# EAGLE design ir_ring_2022_04 (EAGLE 9.6.2)
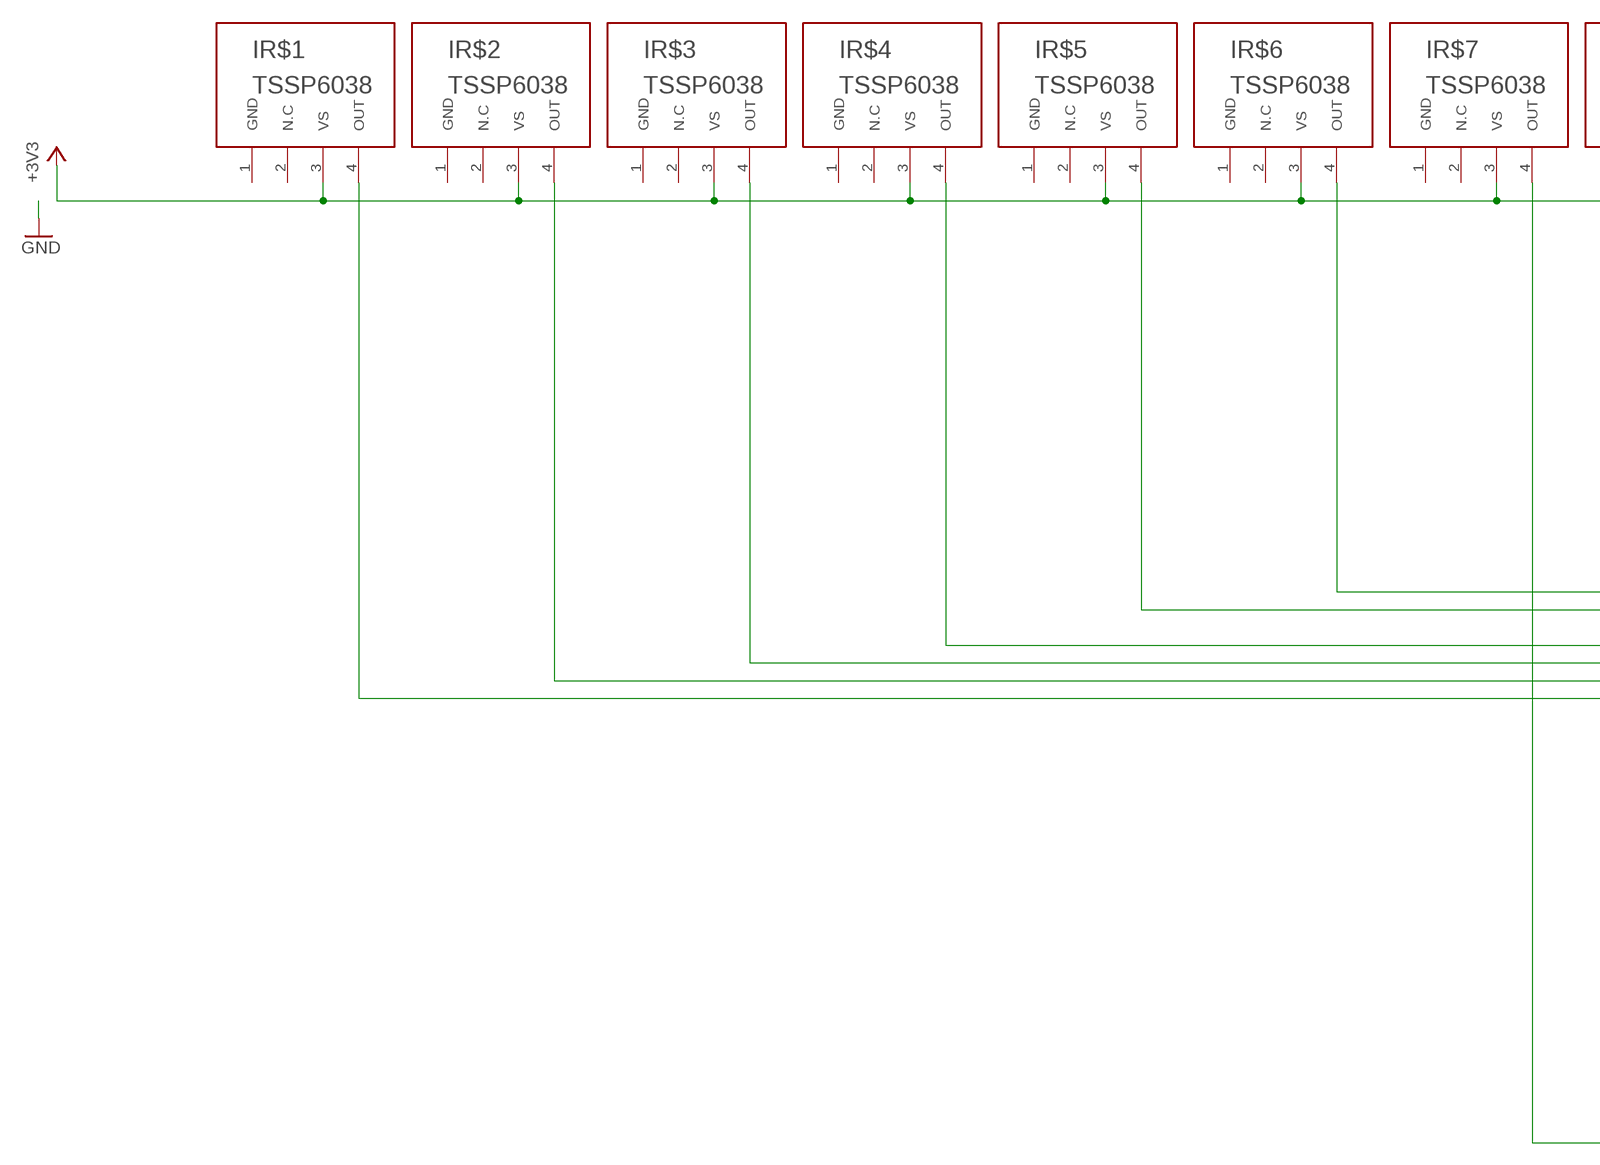
[diagram p0: schematic, sheet 1, part 1 of 2]
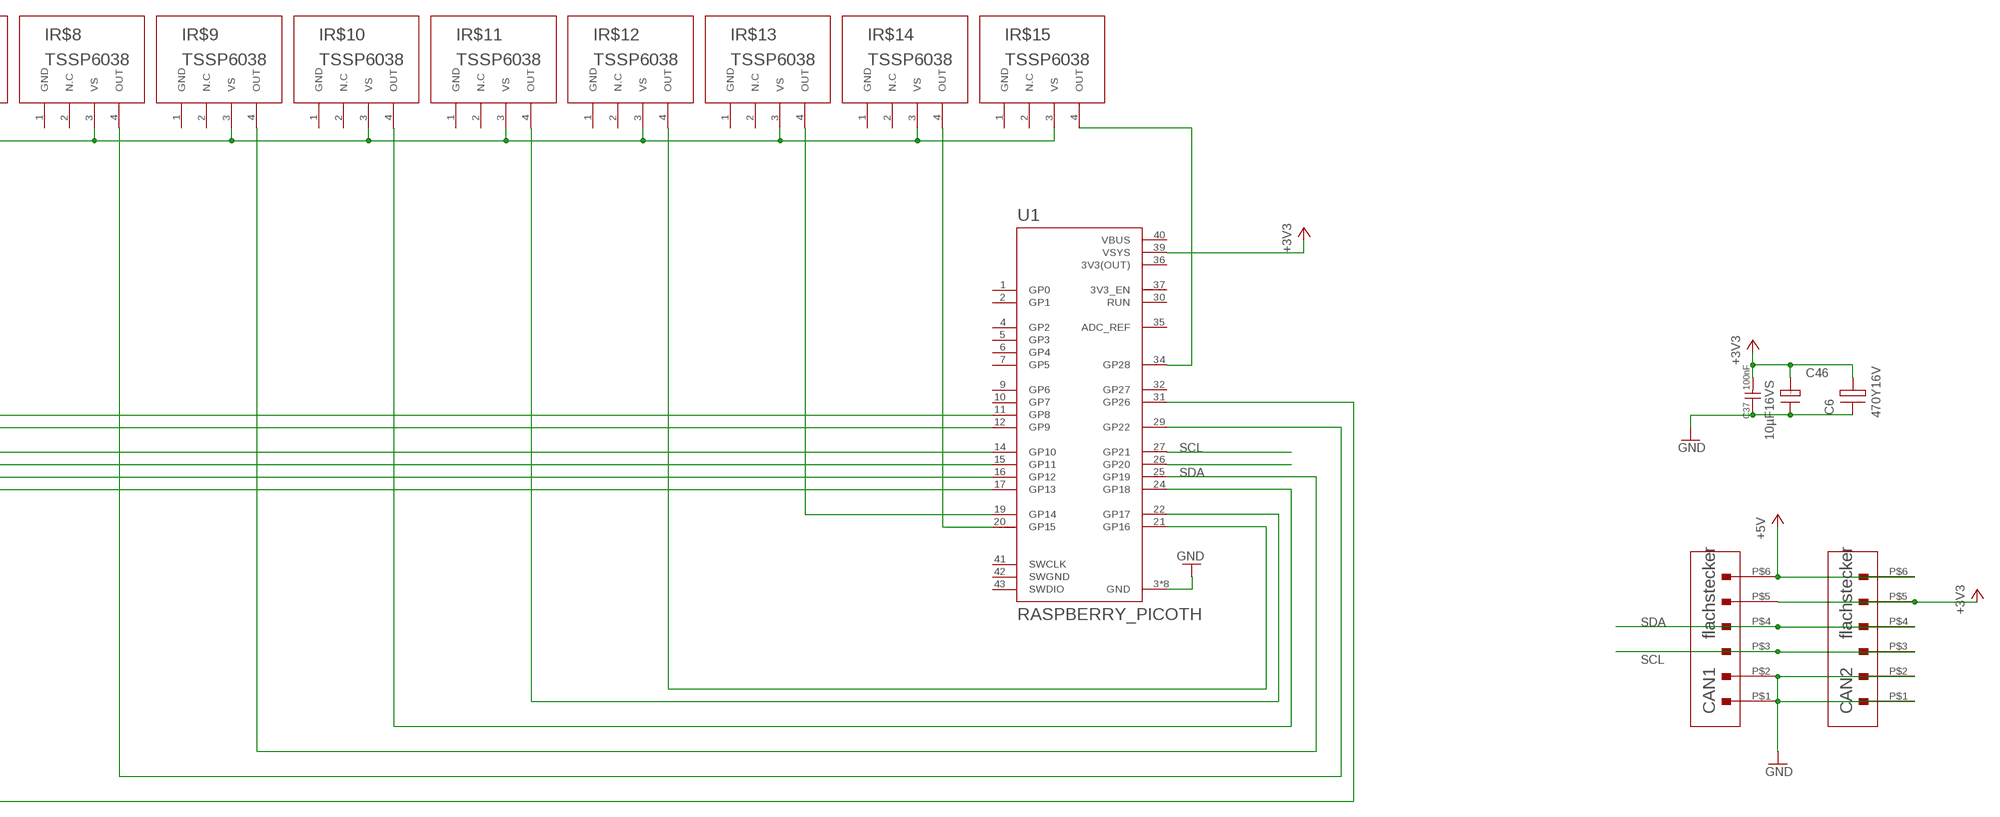
[diagram p1: schematic, sheet 1, part 2 of 2]

## Parts
C6  470Y16V  [150CLZ-1010]
C37  100nF  C0805  [0805]
C46  10µF16VS  [TANTALC]
CAN1  flachstecker  MOLEX104078-0610  [MOLEX104078-0610]
CAN2  flachstecker  MOLEX104078-0610  [MOLEX104078-0610]
IR$1  TSSP6038  [TSSP6038]
IR$2  TSSP6038  [TSSP6038]
IR$3  TSSP6038  [TSSP6038]
IR$4  TSSP6038  [TSSP6038]
IR$5  TSSP6038  [TSSP6038]
IR$6  TSSP6038  [TSSP6038]
IR$7  TSSP6038  [TSSP6038]
IR$8  TSSP6038  [TSSP6038]
IR$9  TSSP6038  [TSSP6038]
IR$10  TSSP6038  [TSSP6038]
IR$11  TSSP6038  [TSSP6038]
IR$12  TSSP6038  [TSSP6038]
IR$13  TSSP6038  [TSSP6038]
IR$14  TSSP6038  [TSSP6038]
IR$15  TSSP6038  [TSSP6038]
U1  RASPBERRY_PICOTH  [PICO-PKG-TH]

## Nets
+3V3: C6.+ C37.1 C46.+ CAN1.P$5 CAN2.P$5 IR$1.3(VS) IR$2.3(VS) IR$3.3(VS) IR$4.3(VS) IR$5.3(VS) IR$6.3(VS) IR$7.3(VS) IR$8.3(VS) IR$9.3(VS) IR$10.3(VS) IR$11.3(VS) IR$12.3(VS) IR$13.3(VS) IR$14.3(VS) IR$15.3(VS) U1.39(VSYS)
+5V: CAN1.P$6 CAN2.P$6
GND: C6.- C37.2 C46.- CAN1.P$1 CAN1.P$2 CAN2.P$1 CAN2.P$2 U1.3(GND) U1.8(GND) U1.13(GND) U1.18(GND) U1.23(GND) U1.28(GND) U1.33(GND) U1.38(GND)
N$1: IR$1.4(OUT) U1.17(GP13)
N$2: IR$2.4(OUT) U1.16(GP12)
N$3: IR$3.4(OUT) U1.15(GP11)
N$4: IR$4.4(OUT) U1.14(GP10)
N$5: IR$5.4(OUT) U1.12(GP9)
N$6: IR$6.4(OUT) U1.11(GP8)
N$7: IR$7.4(OUT) U1.31(GP26)
N$8: IR$8.4(OUT) U1.29(GP22)
N$9: IR$9.4(OUT) U1.25(GP19)
N$10: IR$10.4(OUT) U1.24(GP18)
N$11: IR$11.4(OUT) U1.22(GP17)
N$12: IR$12.4(OUT) U1.21(GP16)
N$13: IR$14.4(OUT) U1.20(GP15)
N$14: IR$13.4(OUT) U1.19(GP14)
N$15: IR$15.4(OUT) U1.34(GP28)
SCL: CAN1.P$3 CAN2.P$3 U1.27(GP21)
SDA: CAN1.P$4 CAN2.P$4 U1.26(GP20)
Unconnected: IR$1.2(N.C) IR$2.2(N.C) IR$3.2(N.C) IR$4.2(N.C) IR$5.2(N.C) IR$6.2(N.C) IR$7.2(N.C) IR$8.2(N.C) IR$9.2(N.C) IR$10.2(N.C) IR$11.2(N.C) IR$12.2(N.C) IR$13.2(N.C) IR$14.2(N.C) IR$15.2(N.C) U1.1(GP0) U1.2(GP1) U1.4(GP2) U1.5(GP3) U1.6(GP4) U1.7(GP5) U1.9(GP6) U1.10(GP7) U1.30(RUN) U1.32(GP27) U1.35(ADC_REF) U1.37(3V3_EN) U1.41(SWCLK) U1.43(SWDIO)

## Power pins joined to a net without a drawn wire
3V3(OUT): U1.36(3V3(OUT))
GND: IR$1.1(GND) IR$2.1(GND) IR$3.1(GND) IR$4.1(GND) IR$5.1(GND) IR$6.1(GND) IR$7.1(GND) IR$8.1(GND) IR$9.1(GND) IR$10.1(GND) IR$11.1(GND) IR$12.1(GND) IR$13.1(GND) IR$14.1(GND) IR$15.1(GND)
SWGND: U1.42(SWGND)
VBUS: U1.40(VBUS)

## Library data of the parts
C6 = ELKO_SMD:470Y16V: 470uF 16V 10x10,5mm
C37 = KONDENSA:C0805
C46 = ELKO:10µF16V
CAN1 CAN2 = Roboter:MOLEX104078-0610
IR$1-IR$15 = IC:TSSP6038
U1 = RpiPico:RASPBERRY_PICO: Raspberry Pi Pico

## Board
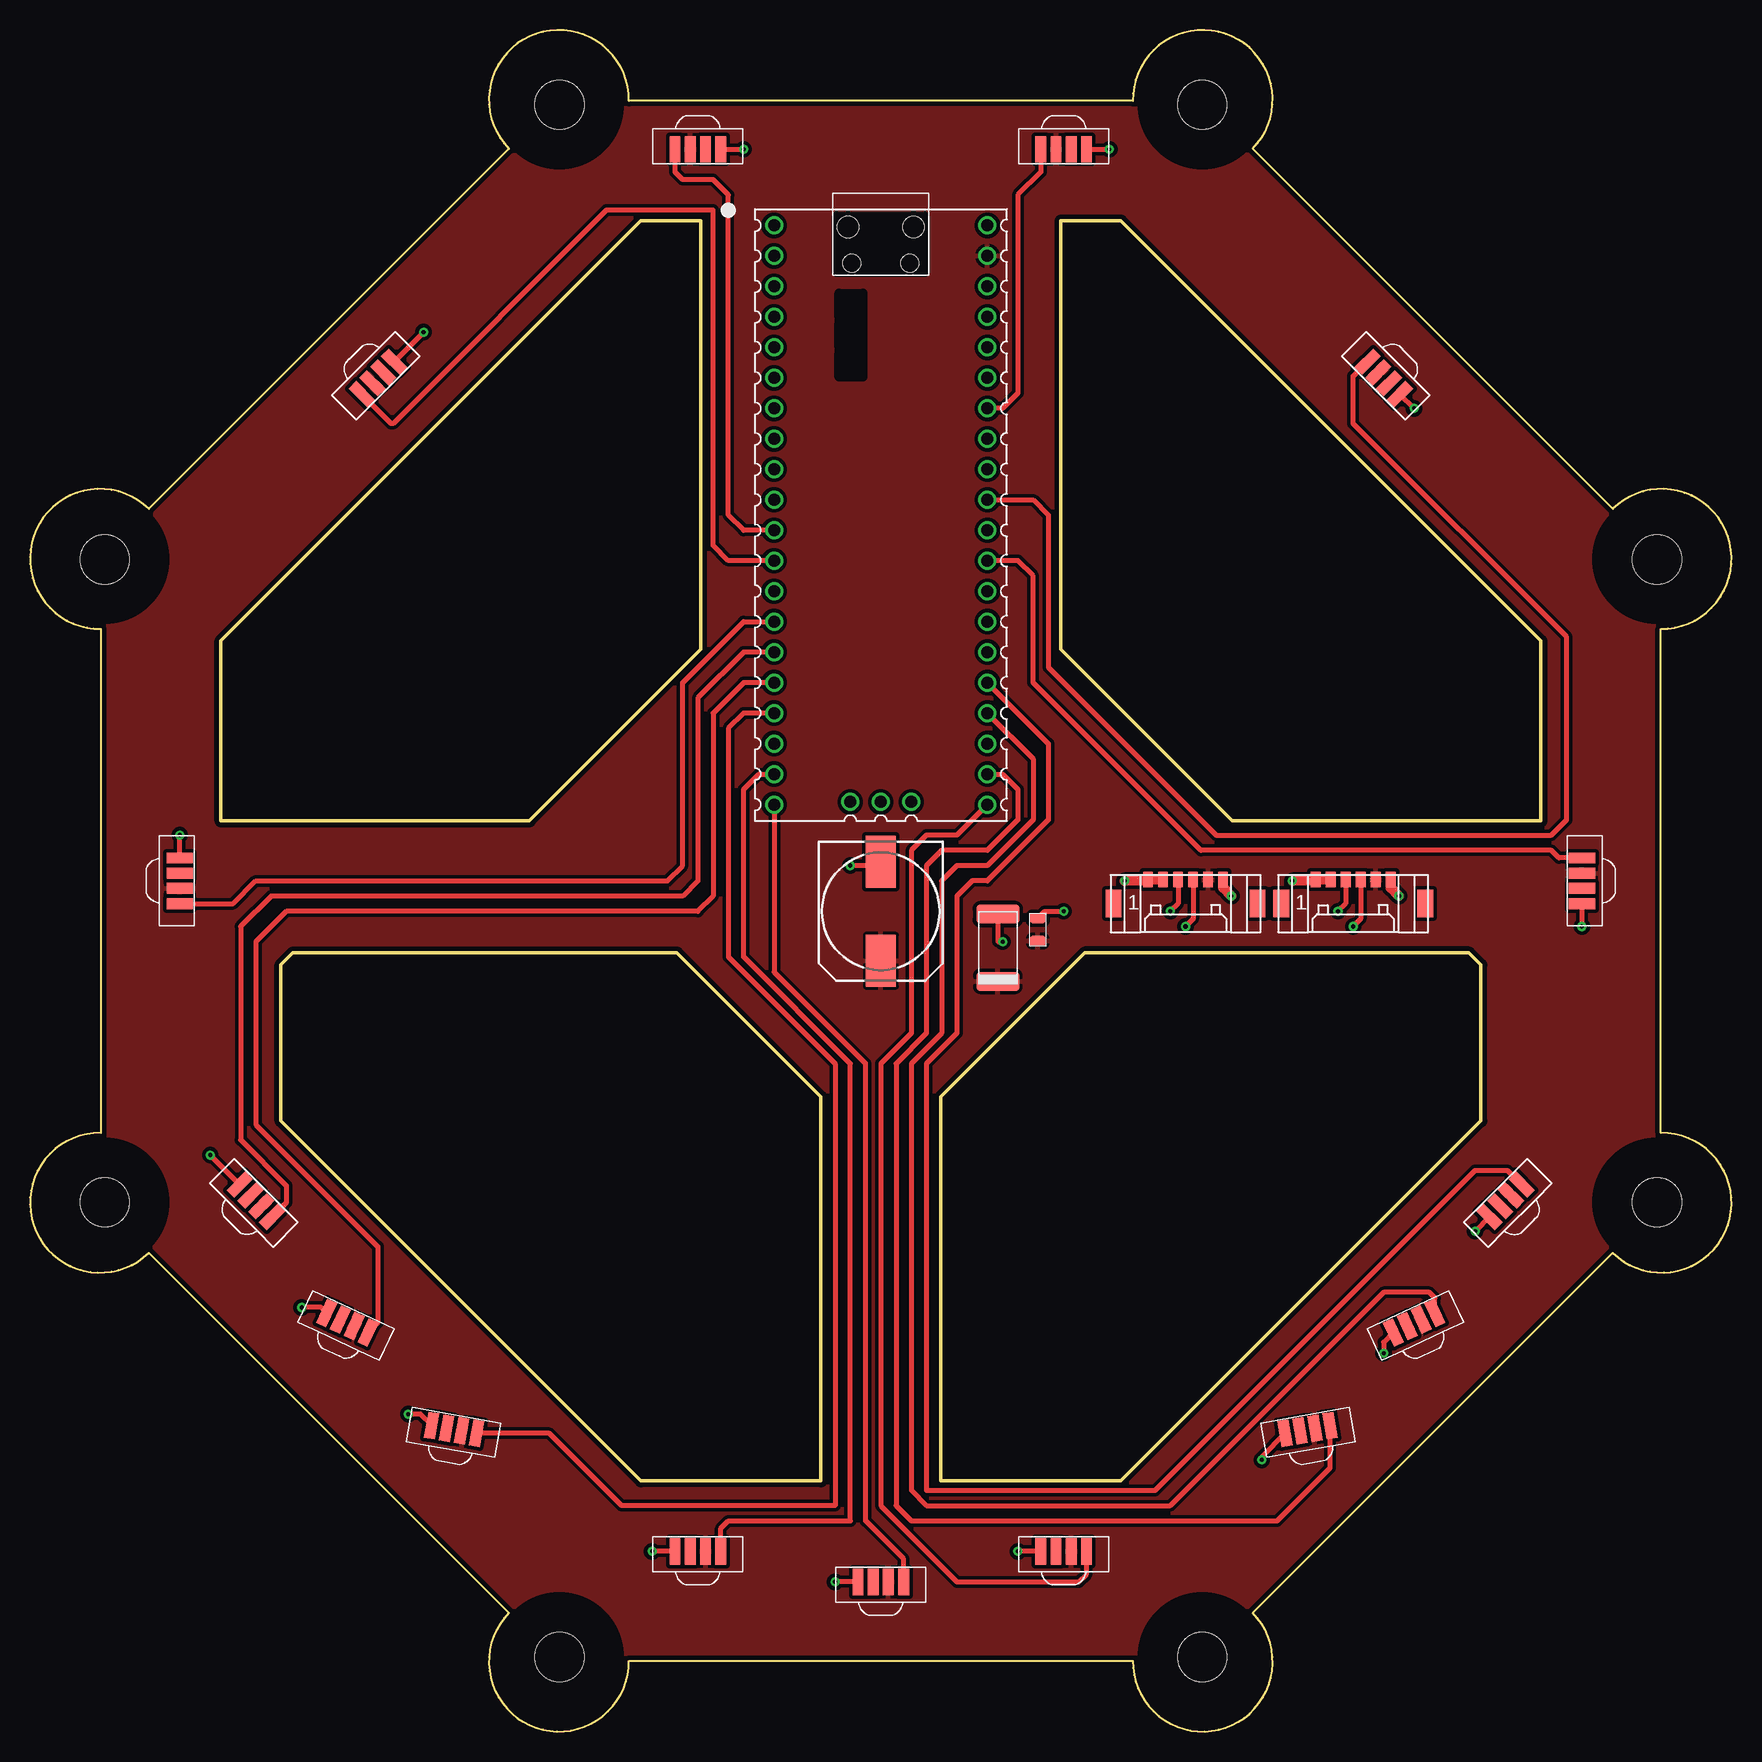
[diagram p2: board, top side]
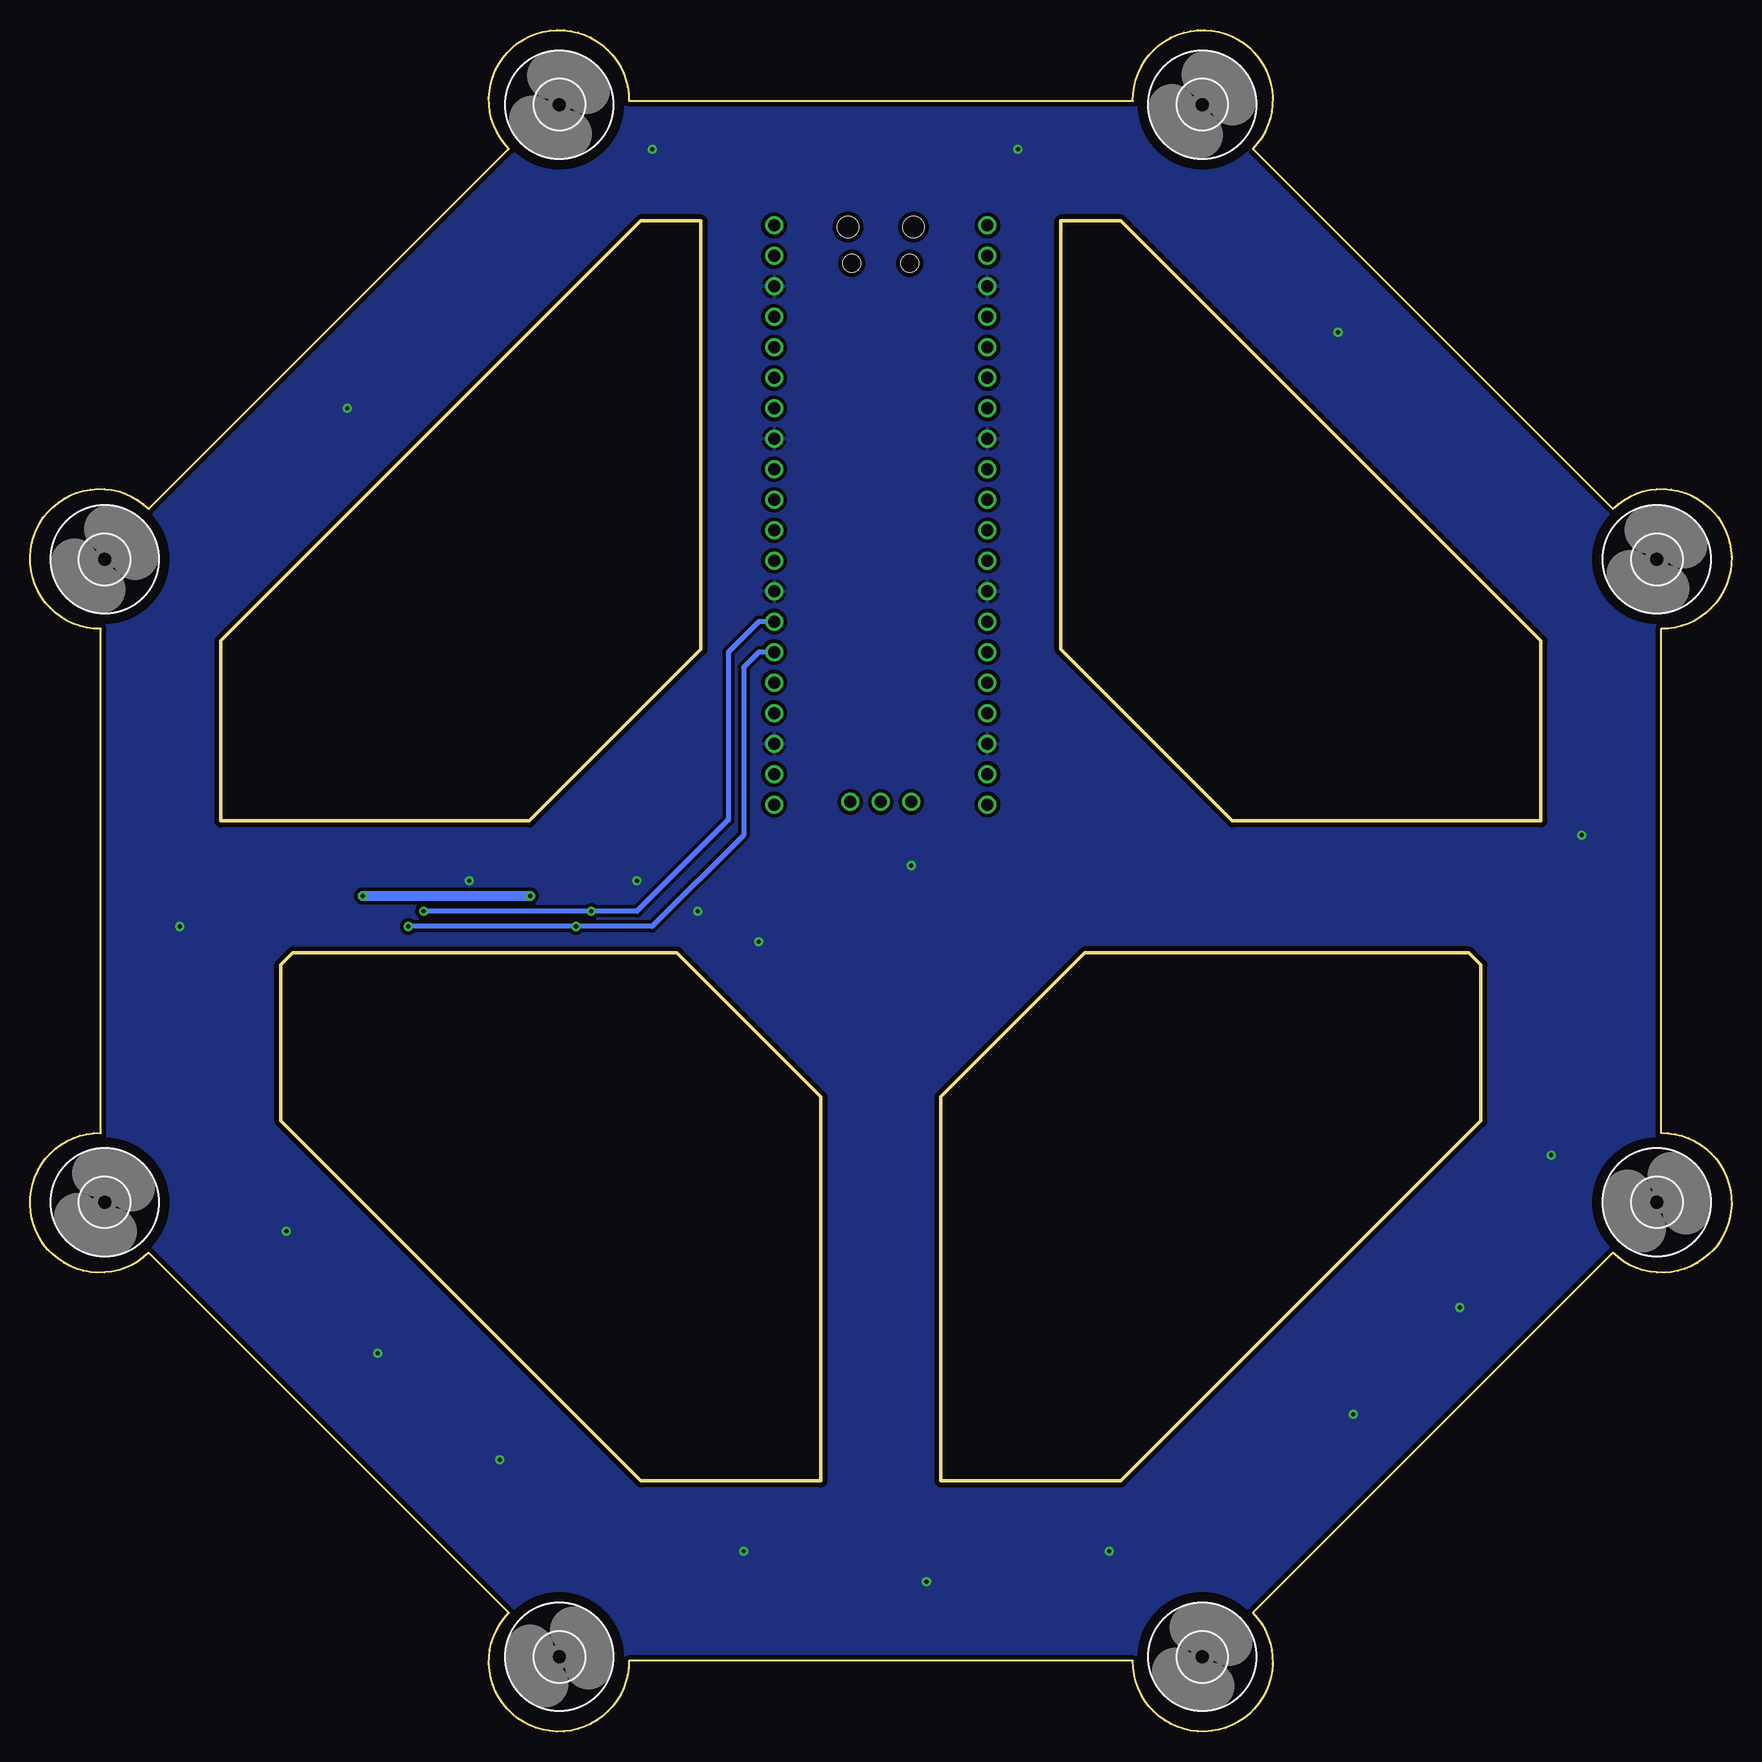
[diagram p3: board, bottom side, seen from below]

Size 141.8 x 141.8 mm. Coordinates in mm from the lower left corner, seen from the top.
Outline: 135.9,49.9 135.9,91.9 arc225 131.9,101.9 101.9,131.9 arc225 91.9,135.9 49.9,135.9 arc225 39.9,131.9 9.9,101.9 arc225 5.9,91.9 5.9,49.9 arc225 9.9,39.9 39.9,9.9 arc225 49.9,5.9 91.9,5.9 arc225 101.9,9.9 131.9,39.9 arc225 135.9,49.9
Outline: 85.9,125.9 85.9,90.19 100.19,75.9 125.9,75.9 125.9,90.9 90.9,125.9 85.9,125.9
Outline: 120.9,50.9 120.9,63.9 119.9,64.9 87.9,64.9 75.9,52.9 75.9,20.9 90.9,20.9 120.9,50.9
Outline: 15.9,75.9 41.61,75.9 55.9,90.19 55.9,125.9 50.9,125.9 15.9,90.9 15.9,75.9
Outline: 65.9,20.9 50.9,20.9 20.9,50.9 20.9,63.9 21.9,64.9 53.9,64.9 65.9,52.9 65.9,20.9
Copper layers (1*16): Top 0.035mm / dielectric 1.5mm / Bottom 0.035mm
Design rules "Normal-Pitch 2Layer": minimum track width 8mil, minimum drill 8mil, track to track 8mil, track to pad 8mil, pad to pad 8mil, via to via 8mil, smd to smd 8mil, copper to edge 15mil, drill to drill 8mil, minimum pad ring 10mil, minimum via ring 8mil, stop-mask expansion 0mil, vias tented up to drill 0mil, thermal gap 10mil

### Footprints (pad centres in the part's own frame; a part is rotated, then mirrored left to right if it is on the bottom)
150CLZ-1010 = smd 4.3 x 2.5: + 4.128,0; - -4.128,0
0805 = smd 0.864 x 1.397: 1 -0.953,0; 2 0.953,0
TANTALC = smd 1.6 x 3.6: + -2.8,0; - 2.8,0
MOLEX104078-0610 = smd 0.8 x 1.3: P$1 -3.125,2; P$2 -1.875,2; P$3 -0.625,2; P$4 0.625,2; P$5 1.875,2; P$6 3.125,2 | smd 1.3 x 2.3: P$7 -6,0; P$8 6,0
4,1 = hole 4.1: 0,0
TSSP6038 = smd 0.9 x 2.2: 1 -1.905,0; 2 -0.635,0; 3 0.635,0; 4 1.905,0
PICO-PKG-TH = drill 1: 1 -8.89,24.13; 2 -8.89,21.59; 3 -8.89,19.05; 4 -8.89,16.51; 5 -8.89,13.97; 6 -8.89,11.43; 7 -8.89,8.89; 8 -8.89,6.35; 9 -8.89,3.81; 10 -8.89,1.27; 11 -8.89,-1.27; 12 -8.89,-3.81; 13 -8.89,-6.35; 14 -8.89,-8.89; 15 -8.89,-11.43; 16 -8.89,-13.97; 17 -8.89,-16.51; 18 -8.89,-19.05; 19 -8.89,-21.59; 20 -8.89,-24.13; 21 8.89,-24.13; 22 8.89,-21.59; 23 8.89,-19.05; 24 8.89,-16.51; 25 8.89,-13.97; 26 8.89,-11.43; 27 8.89,-8.89; 28 8.89,-6.35; 29 8.89,-3.81; 30 8.89,-1.27; 31 8.89,1.27; 32 8.89,3.81; 33 8.89,6.35; 34 8.89,8.89; 35 8.89,11.43; 36 8.89,13.97; 37 8.89,16.51; 38 8.89,19.05; 39 8.89,21.59; 40 8.89,24.13; 41 -2.54,-23.9; 42 0,-23.9; 43 2.54,-23.9 | hole 1.8: -2.725,24; 2.725,24 | hole 1.5: -2.425,20.97; 2.425,20.97

### Placement (x,y rotation side)
C6  70.9,68.36 270 top
C37  83.98,66.83 90 top
C46  80.65,65.31 90 top
CAN1  110.27,68.99 0 top
CAN2  96.3,68.99 0 top
H1  MOUNT-HOLE4.1  [4,1]  6.23,97.69 22.5 bottom
H2  MOUNT-HOLE4.1  [4,1]  44.11,6.23 22.5 bottom
H3  MOUNT-HOLE4.1  [4,1]  135.57,44.11 22.5 bottom
H4  MOUNT-HOLE4.1  [4,1]  44.11,135.57 0 bottom
H5  MOUNT-HOLE4.1  [4,1]  97.69,135.57 22.5 bottom
H6  MOUNT-HOLE4.1  [4,1]  6.23,44.11 337.5 bottom
H7  MOUNT-HOLE4.1  [4,1]  97.69,6.23 337.5 bottom
H8  MOUNT-HOLE4.1  [4,1]  135.57,97.69 0 bottom
IR$1  35.34,25.18 350 top
IR$2  26.45,34.07 335 top
IR$3  18.83,44.23 315 top
IR$4  12.48,70.9 270 top
IR$5  28.99,112.81 225 top
IR$6  55.66,131.86 180 top
IR$7  112.81,112.81 135 top
IR$8  129.32,70.9 90 top
IR$9  122.97,44.23 45 top
IR$10  115.35,34.07 25 top
IR$11  106.46,25.18 10 top
IR$12  86.14,15.02 0 top
IR$13  55.66,15.02 0 top
IR$14  70.9,12.48 0 top
IR$15  86.14,131.86 180 top
U1  70.9,101.38 0 top

### Tracks (layer width: path | path; a pad name or v marks a point on that pad's centre or on a via)
+3V3
  pour Top (isolate 0.305, rank 2): -3.4,157.26 147.1,157.26 155.35,149 155.35,0.41 152.18,-2.76 10.57,-2.76 -37.69,45.5 -37.69,122.97
+5V  (via drill 0.35)
  Top 0.813: v100.11,69.63 99.42,70.31 CAN2.P$6 | v114.08,69.63 113.39,70.31 CAN1.P$6
  Bottom 0.813: v100.11,69.63 v114.08,69.63
GND  (via drill 0.35)
  Top 0.406: CAN1.P$1 107.05,70.9 | CAN2.P$1 93.08,70.9 | 71.22,72.17 C6.- 70.58,72.17 v68.36,72.17 | C46.- 80.65,65.82 v81.06,65.82 | C37.2 84.55,68.36 v86.14,68.36 | IR$6.1 v59.47,131.86 | IR$5.1 v32.8,116.62 | v32.8,116.62 | IR$4.1 v12.48,74.71 | IR$3.1 v15.02,48.04 | v15.02,48.04 | IR$2.1 24.26,35.34 v22.64,35.34 | IR$1.1 32.52,26.45 v31.53,26.45 | IR$13.1 v51.85,15.02 | IR$14.1 v67.09,12.48 | IR$12.1 v82.33,15.02 | IR$11.1 102.65,22.91 v102.65,22.64 | IR$10.1 112.81,32.45 v112.81,31.53 | IR$9.1 | IR$9.1 v120.43,41.69 | IR$8.1 v129.32,67.09 | IR$7.1 v115.35,110.27 | v115.35,110.27 | IR$15.1 v89.95,131.86
  Top 0.813: CAN1.P$2 CAN1.P$1 | 107.05,70.9 v105.19,70.9 | CAN2.P$2 CAN2.P$1 | 93.08,70.9 v91.22,70.9
  pour Bottom (isolate 0.305): -31.34,70.9 arc-90 70.9,173.13 arc-90 173.13,70.9 arc-90 70.9,-31.34 arc-90
N$1
  Top 0.406: U1.17 59.47,84.87 58.2,83.6 58.2,64.55 67.09,55.66 67.09,18.83 49.31,18.83 43.29,24.85 IR$1.4
N$2
  Top 0.406: U1.16 59.47,87.41 56.93,84.87 56.93,69.63 55.66,68.36 21.37,68.36 18.83,65.82 18.83,50.58 28.99,40.42 28.99,34.08 IR$2.4
N$3
  Top 0.406: U1.15 59.47,89.95 55.66,86.14 55.66,70.9 54.39,69.63 20.1,69.63 17.56,67.09 17.56,49.31 21.37,45.5 21.37,44.07 IR$3.4
N$4
  Top 0.406: IR$4.4 16.92,68.99 18.83,70.9 53.12,70.9 54.39,72.17 54.39,87.41 59.47,92.49 U1.14
N$5
  Top 0.406: U1.12 58.2,97.57 56.93,98.84 56.93,126.78 48.04,126.78 30.26,109 30.1,109 IR$5.4
N$6
  Top 0.406: U1.11 59.47,100.11 58.2,101.38 58.2,128.05 56.93,129.32 54.39,129.32 53.75,129.95 IR$6.4
N$7
  Top 0.406: U1.31 83.6,102.65 84.87,101.38 84.87,88.68 98.84,74.71 126.78,74.71 128.05,75.98 128.05,91.22 110.27,109 110.27,112.96 IR$7.4
N$8
  Top 0.406: IR$8.4 127.41,72.8 126.78,73.44 97.57,73.44 83.6,87.41 83.6,96.3 82.33,97.57 U1.29
N$9
  Top 0.406: U1.25 84.87,82.33 84.87,75.98 79.79,70.9 78.52,70.9 77.25,69.63 77.25,58.2 74.71,55.66 74.71,20.1 93.76,20.1 120.43,46.77 123.12,46.77 IR$9.4
N$10
  Top 0.406: U1.24 83.6,81.06 83.6,75.98 79.79,72.17 77.25,72.17 75.98,70.9 75.98,58.2 73.44,55.66 73.44,20.1 74.71,18.83 95.03,18.83 112.81,36.61 116.62,36.61 116.62,36.6 117.07,36.14 IR$10.4
N$11
  Top 0.406: U1.22 81.06,79.79 82.33,78.52 82.33,75.98 79.79,73.44 75.98,73.44 74.71,72.17 74.71,58.2 72.17,55.66 72.17,18.83 73.44,17.56 103.92,17.56 108.33,21.97 IR$11.4
N$12
  Top 0.406: U1.21 77.25,74.71 74.71,74.71 73.44,73.44 73.44,58.2 70.9,55.66 70.9,18.83 77.25,12.48 87.41,12.48 88.04,13.11 IR$12.4
N$13
  Top 0.406: U1.20 62.01,63.28 69.63,55.66 69.63,17.56 72.8,14.38 IR$14.4
N$14
  Top 0.406: IR$13.4 57.56,16.92 58.2,17.56 68.36,17.56 68.36,55.66 59.47,64.55 59.47,78.52 60.74,79.79 U1.19
N$15
  Top 0.406: IR$15.4 84.23,129.95 82.33,128.05 82.33,111.54 81.06,110.27 U1.34
SCL  (via drill 0.35)
  Top 0.406: CAN1.P$3 109.64,69 v109,68.36 | CAN2.P$3 95.67,69 v95.03,68.36
  Bottom 0.406: U1.27 81.06,92.49 83.6,89.95 83.6,75.98 91.22,68.36 v95.03,68.36 v109,68.36
SDA  (via drill 0.35)
  Top 0.406: CAN2.P$4 96.92,67.71 v96.3,67.09 | CAN1.P$4 110.89,67.71 v110.27,67.09
  Bottom 0.406: U1.26 81.06,89.95 82.33,88.68 82.33,74.71 89.95,67.09 v96.3,67.09 v110.27,67.09